# EAGLE schematic power_tower_mast (EAGLE 7.1.0)
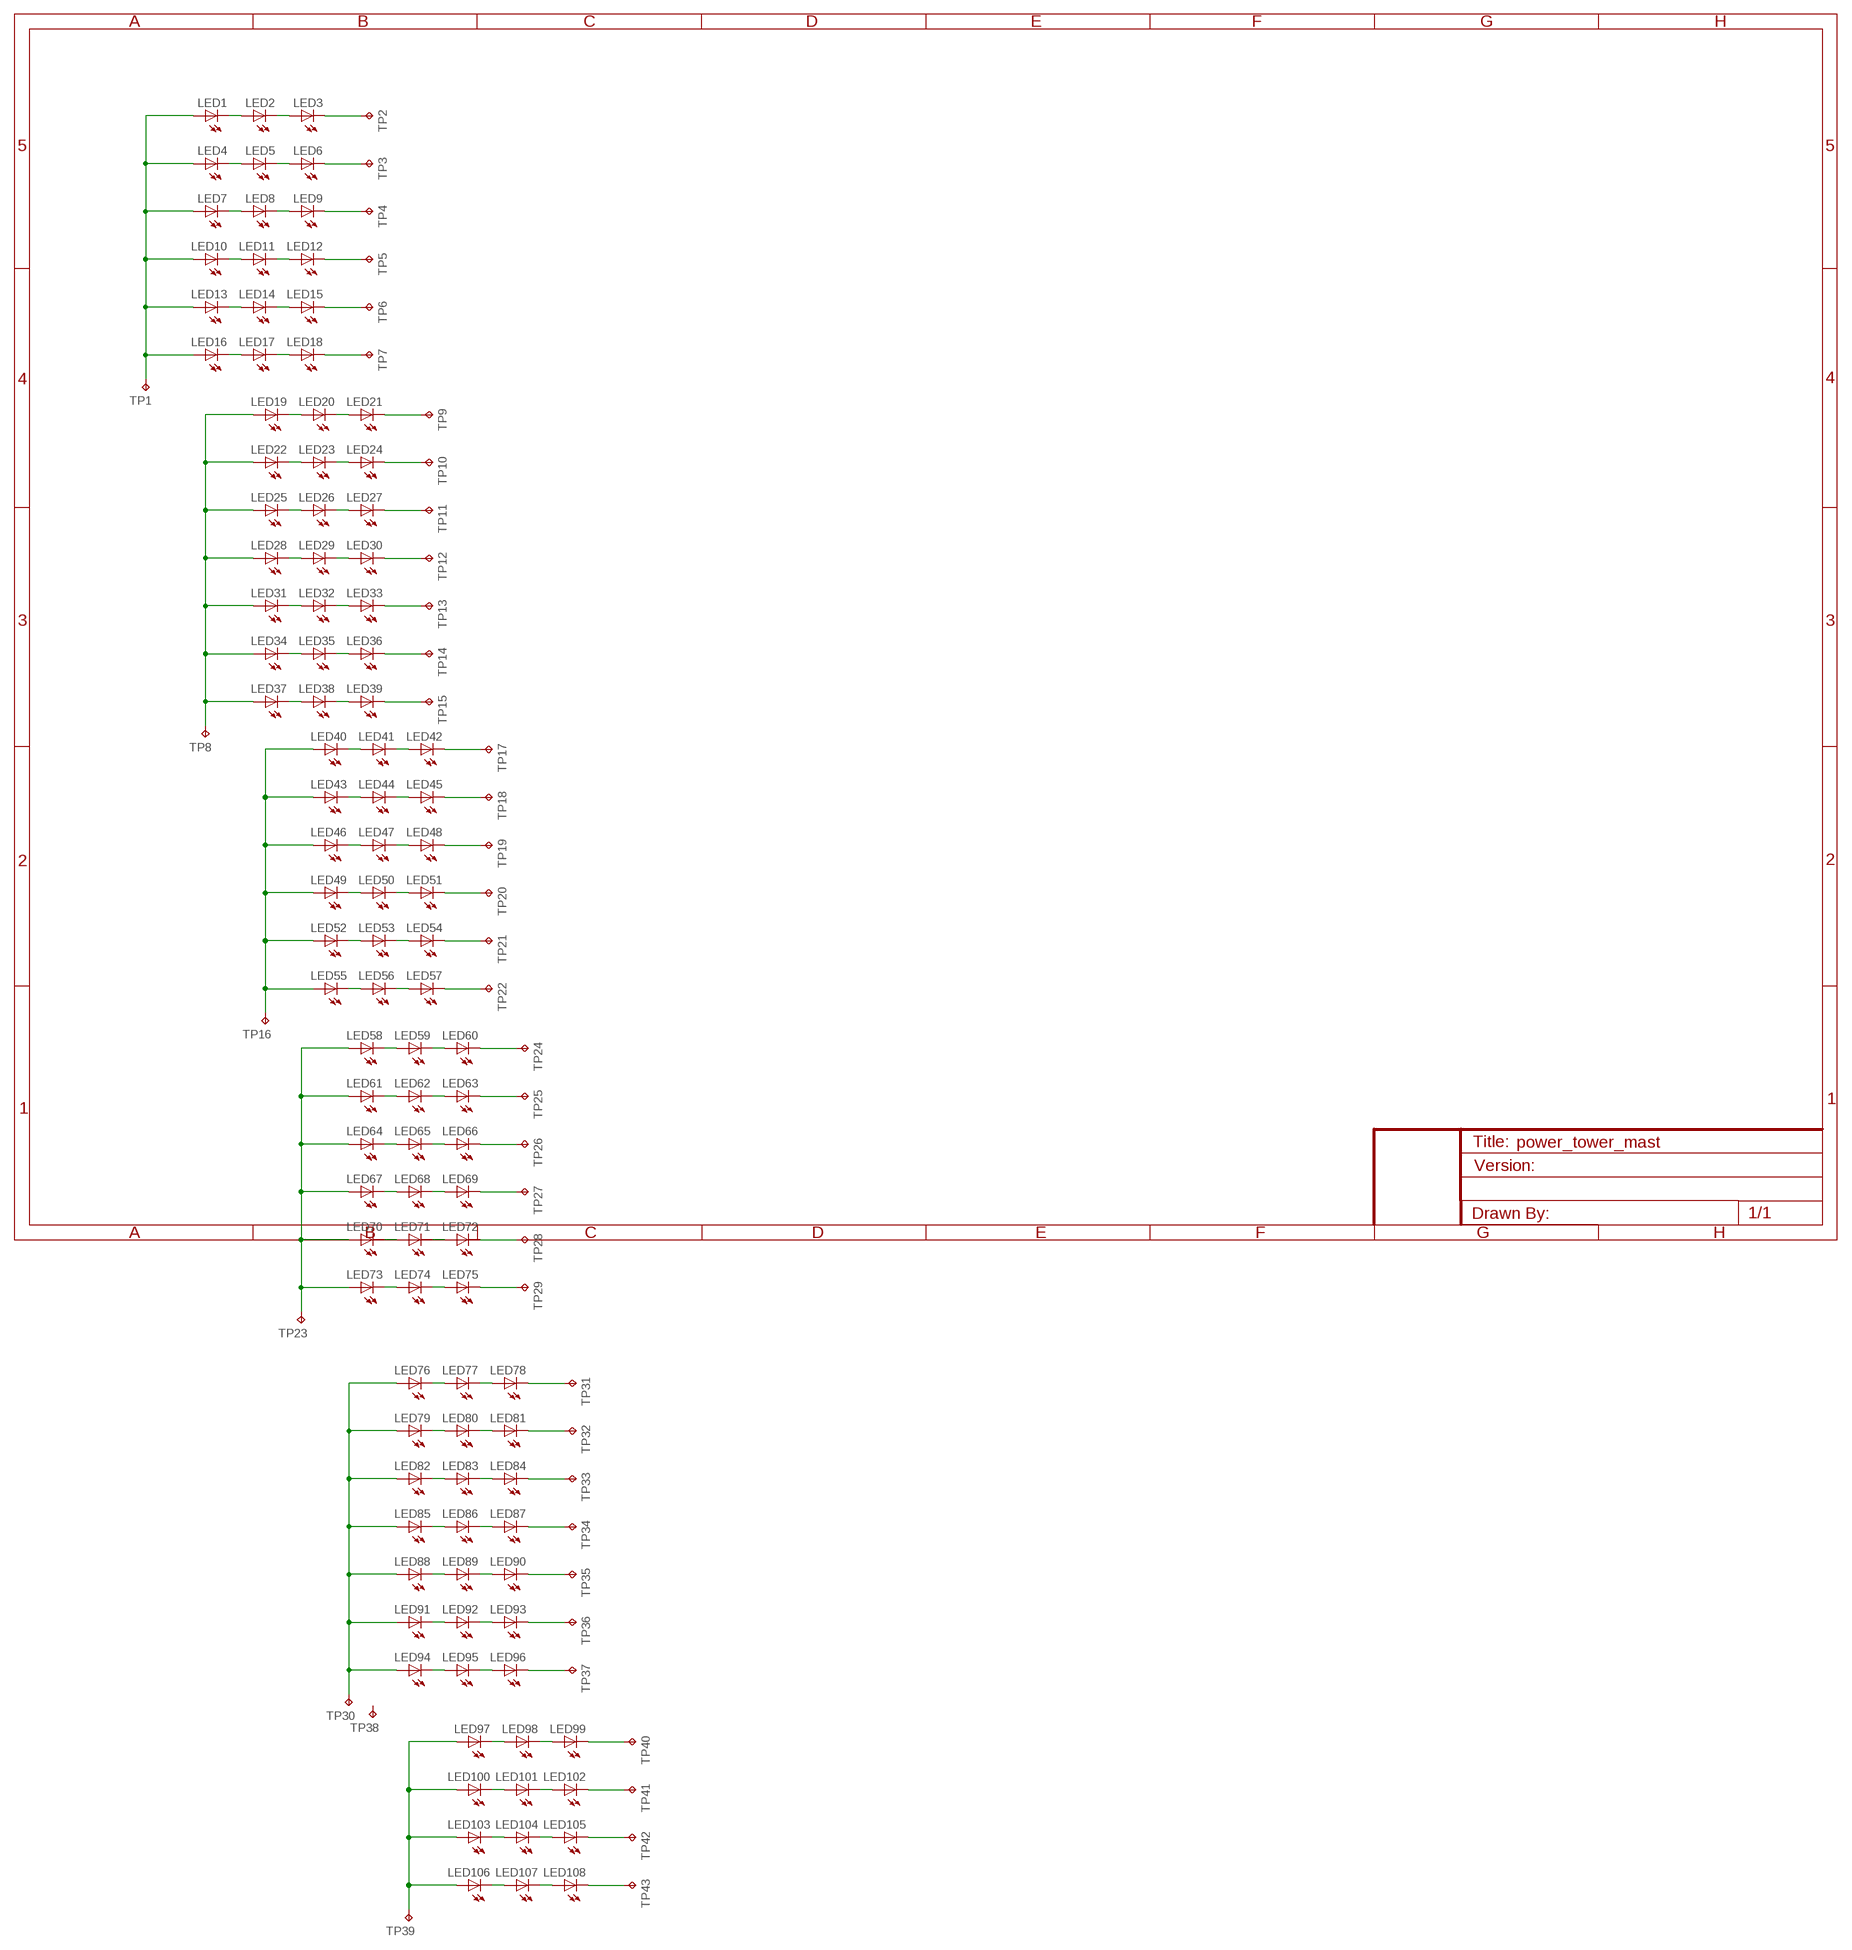
[diagram p0: schematic, sheet 1]

## Parts
LED1  LED0805  [LED_0805]
LED2  LED0805  [LED_0805]
LED3  LED0805  [LED_0805]
LED4  LED0805  [LED_0805]
LED5  LED0805  [LED_0805]
LED6  LED0805  [LED_0805]
LED7  LED0805  [LED_0805]
LED8  LED0805  [LED_0805]
LED9  LED0805  [LED_0805]
LED10  LED0805  [LED_0805]
LED11  LED0805  [LED_0805]
LED12  LED0805  [LED_0805]
LED13  LED0805  [LED_0805]
LED14  LED0805  [LED_0805]
LED15  LED0805  [LED_0805]
LED16  LED0805  [LED_0805]
LED17  LED0805  [LED_0805]
LED18  LED0805  [LED_0805]
LED19  LED0805  [LED_0805]
LED20  LED0805  [LED_0805]
LED21  LED0805  [LED_0805]
LED22  LED0805  [LED_0805]
LED23  LED0805  [LED_0805]
LED24  LED0805  [LED_0805]
LED25  LED0805  [LED_0805]
LED26  LED0805  [LED_0805]
LED27  LED0805  [LED_0805]
LED28  LED0805  [LED_0805]
LED29  LED0805  [LED_0805]
LED30  LED0805  [LED_0805]
LED31  LED0805  [LED_0805]
LED32  LED0805  [LED_0805]
LED33  LED0805  [LED_0805]
LED34  LED0805  [LED_0805]
LED35  LED0805  [LED_0805]
LED36  LED0805  [LED_0805]
LED37  LED0805  [LED_0805]
LED38  LED0805  [LED_0805]
LED39  LED0805  [LED_0805]
LED40  LED0805  [LED_0805]
LED41  LED0805  [LED_0805]
LED42  LED0805  [LED_0805]
LED43  LED0805  [LED_0805]
LED44  LED0805  [LED_0805]
LED45  LED0805  [LED_0805]
LED46  LED0805  [LED_0805]
LED47  LED0805  [LED_0805]
LED48  LED0805  [LED_0805]
LED49  LED0805  [LED_0805]
LED50  LED0805  [LED_0805]
LED51  LED0805  [LED_0805]
LED52  LED0805  [LED_0805]
LED53  LED0805  [LED_0805]
LED54  LED0805  [LED_0805]
LED55  LED0805  [LED_0805]
LED56  LED0805  [LED_0805]
LED57  LED0805  [LED_0805]
LED58  LED0805  [LED_0805]
LED59  LED0805  [LED_0805]
LED60  LED0805  [LED_0805]
LED61  LED0805  [LED_0805]
LED62  LED0805  [LED_0805]
LED63  LED0805  [LED_0805]
LED64  LED0805  [LED_0805]
LED65  LED0805  [LED_0805]
LED66  LED0805  [LED_0805]
LED67  LED0805  [LED_0805]
LED68  LED0805  [LED_0805]
LED69  LED0805  [LED_0805]
LED70  LED0805  [LED_0805]
LED71  LED0805  [LED_0805]
LED72  LED0805  [LED_0805]
LED73  LED0805  [LED_0805]
LED74  LED0805  [LED_0805]
LED75  LED0805  [LED_0805]
LED76  LED0805  [LED_0805]
LED77  LED0805  [LED_0805]
LED78  LED0805  [LED_0805]
LED79  LED0805  [LED_0805]
LED80  LED0805  [LED_0805]
LED81  LED0805  [LED_0805]
LED82  LED0805  [LED_0805]
LED83  LED0805  [LED_0805]
LED84  LED0805  [LED_0805]
LED85  LED0805  [LED_0805]
LED86  LED0805  [LED_0805]
LED87  LED0805  [LED_0805]
LED88  LED0805  [LED_0805]
LED89  LED0805  [LED_0805]
LED90  LED0805  [LED_0805]
LED91  LED0805  [LED_0805]
LED92  LED0805  [LED_0805]
LED93  LED0805  [LED_0805]
LED94  LED0805  [LED_0805]
LED95  LED0805  [LED_0805]
LED96  LED0805  [LED_0805]
LED97  LED0805  [LED_0805]
LED98  LED0805  [LED_0805]
LED99  LED0805  [LED_0805]
LED100  LED0805  [LED_0805]
LED101  LED0805  [LED_0805]
LED102  LED0805  [LED_0805]
LED103  LED0805  [LED_0805]
LED104  LED0805  [LED_0805]
LED105  LED0805  [LED_0805]
LED106  LED0805  [LED_0805]
LED107  LED0805  [LED_0805]
LED108  LED0805  [LED_0805]
TP1  TEST_POINTPAD1-20  [P1-20]
TP2  TEST_POINTPAD1-20  [P1-20]
TP3  TEST_POINTPAD1-20  [P1-20]
TP4  TEST_POINTPAD1-20  [P1-20]
TP5  TEST_POINTPAD1-20  [P1-20]
TP6  TEST_POINTPAD1-20  [P1-20]
TP7  TEST_POINTPAD1-20  [P1-20]
TP8  TEST_POINTPAD1-20  [P1-20]
TP9  TEST_POINTPAD1-20  [P1-20]
TP10  TEST_POINTPAD1-20  [P1-20]
TP11  TEST_POINTPAD1-20  [P1-20]
TP12  TEST_POINTPAD1-20  [P1-20]
TP13  TEST_POINTPAD1-20  [P1-20]
TP14  TEST_POINTPAD1-20  [P1-20]
TP15  TEST_POINTPAD1-20  [P1-20]
TP16  TEST_POINTPAD1-20  [P1-20]
TP17  TEST_POINTPAD1-20  [P1-20]
TP18  TEST_POINTPAD1-20  [P1-20]
TP19  TEST_POINTPAD1-20  [P1-20]
TP20  TEST_POINTPAD1-20  [P1-20]
TP21  TEST_POINTPAD1-20  [P1-20]
TP22  TEST_POINTPAD1-20  [P1-20]
TP23  TEST_POINTPAD1-20  [P1-20]
TP24  TEST_POINTPAD1-20  [P1-20]
TP25  TEST_POINTPAD1-20  [P1-20]
TP26  TEST_POINTPAD1-20  [P1-20]
TP27  TEST_POINTPAD1-20  [P1-20]
TP28  TEST_POINTPAD1-20  [P1-20]
TP29  TEST_POINTPAD1-20  [P1-20]
TP30  TEST_POINTPAD1-20  [P1-20]
TP31  TEST_POINTPAD1-20  [P1-20]
TP32  TEST_POINTPAD1-20  [P1-20]
TP33  TEST_POINTPAD1-20  [P1-20]
TP34  TEST_POINTPAD1-20  [P1-20]
TP35  TEST_POINTPAD1-20  [P1-20]
TP36  TEST_POINTPAD1-20  [P1-20]
TP37  TEST_POINTPAD1-20  [P1-20]
TP38  TEST_POINTPAD1-20  [P1-20]
TP39  TEST_POINTPAD1-20  [P1-20]
TP40  TEST_POINTPAD1-20  [P1-20]
TP41  TEST_POINTPAD1-20  [P1-20]
TP42  TEST_POINTPAD1-20  [P1-20]
TP43  TEST_POINTPAD1-20  [P1-20]

## Nets
N$1: LED2.C LED3.A
N$2: LED1.C LED2.A
N$3: LED20.C LED21.A
N$4: LED19.C LED20.A
N$5: LED5.C LED6.A
N$6: LED4.C LED5.A
N$7: LED23.C LED24.A
N$8: LED22.C LED23.A
N$9: LED8.C LED9.A
N$10: LED7.C LED8.A
N$11: LED26.C LED27.A
N$12: LED25.C LED26.A
N$13: LED11.C LED12.A
N$14: LED10.C LED11.A
N$15: LED29.C LED30.A
N$16: LED28.C LED29.A
N$17: LED14.C LED15.A
N$18: LED13.C LED14.A
N$19: LED32.C LED33.A
N$20: LED31.C LED32.A
N$21: LED17.C LED18.A
N$22: LED16.C LED17.A
N$23: LED35.C LED36.A
N$24: LED34.C LED35.A
N$25: LED41.C LED42.A
N$26: LED40.C LED41.A
N$27: LED38.C LED39.A
N$28: LED37.C LED38.A
N$29: LED44.C LED45.A
N$30: LED43.C LED44.A
N$31: LED47.C LED48.A
N$32: LED46.C LED47.A
N$33: LED50.C LED51.A
N$34: LED49.C LED50.A
N$35: LED53.C LED54.A
N$36: LED52.C LED53.A
N$37: LED56.C LED57.A
N$38: LED55.C LED56.A
N$39: LED59.C LED60.A
N$40: LED58.C LED59.A
N$41: LED62.C LED63.A
N$42: LED61.C LED62.A
N$43: LED65.C LED66.A
N$44: LED64.C LED65.A
N$45: LED68.C LED69.A
N$46: LED67.C LED68.A
N$47: LED71.C LED72.A
N$48: LED70.C LED71.A
N$49: LED74.C LED75.A
N$50: LED73.C LED74.A
N$51: LED77.C LED78.A
N$52: LED76.C LED77.A
N$53: LED80.C LED81.A
N$54: LED79.C LED80.A
N$55: LED83.C LED84.A
N$56: LED82.C LED83.A
N$57: LED86.C LED87.A
N$58: LED85.C LED86.A
N$59: LED89.C LED90.A
N$60: LED88.C LED89.A
N$61: LED92.C LED93.A
N$62: LED91.C LED92.A
N$63: LED95.C LED96.A
N$64: LED94.C LED95.A
N$65: LED98.C LED99.A
N$66: LED97.C LED98.A
N$67: LED101.C LED102.A
N$68: LED100.C LED101.A
N$69: LED104.C LED105.A
N$70: LED103.C LED104.A
N$71: LED107.C LED108.A
N$72: LED106.C LED107.A
VIN1: LED1.A LED4.A LED7.A LED10.A LED13.A LED16.A TP1.TP
VIN2: LED19.A LED22.A LED25.A LED28.A LED31.A LED34.A LED37.A TP8.TP
VIN3: LED40.A LED43.A LED46.A LED49.A LED52.A LED55.A TP16.TP
VIN4: LED58.A LED61.A LED64.A LED67.A LED70.A LED73.A TP23.TP
VIN5: LED76.A LED79.A LED82.A LED85.A LED88.A LED91.A LED94.A TP30.TP
VIN6: LED97.A LED100.A LED103.A LED106.A TP39.TP
VOUT1: LED3.C TP2.TP
VOUT2: LED6.C TP3.TP
VOUT3: LED9.C TP4.TP
VOUT4: LED12.C TP5.TP
VOUT5: LED15.C TP6.TP
VOUT6: LED18.C TP7.TP
VOUT7: LED21.C TP9.TP
VOUT8: LED24.C TP10.TP
VOUT9: LED27.C TP11.TP
VOUT10: LED30.C TP12.TP
VOUT11: LED33.C TP13.TP
VOUT12: LED36.C TP14.TP
VOUT13: LED39.C TP15.TP
VOUT14: LED42.C TP17.TP
VOUT15: LED45.C TP18.TP
VOUT16: LED48.C TP19.TP
VOUT17: LED51.C TP20.TP
VOUT18: LED54.C TP21.TP
VOUT19: LED57.C TP22.TP
VOUT20: LED60.C TP24.TP
VOUT21: LED63.C TP25.TP
VOUT22: LED66.C TP26.TP
VOUT23: LED69.C TP27.TP
VOUT24: LED72.C TP28.TP
VOUT25: LED75.C TP29.TP
VOUT26: LED78.C TP31.TP
VOUT27: LED81.C TP32.TP
VOUT28: LED84.C TP33.TP
VOUT29: LED87.C TP34.TP
VOUT30: LED90.C TP35.TP
VOUT31: LED93.C TP36.TP
VOUT32: LED96.C TP37.TP
VOUT33: LED99.C TP40.TP
VOUT34: LED102.C TP41.TP
VOUT35: LED105.C TP42.TP
VOUT36: LED108.C TP43.TP
Unconnected: TP38.TP

## Library data of the parts
LED1-LED108 = CyberRailGuru:LED: LEDs Standard schematic elements and footprints for 5mm, 3mm, 1206, and 0603 sized LEDs. 5mm - Spark Fun Electronics SKU : COM-00529 (and others)
TP1-TP43 = CyberRailGuru:TEST_POINT: Test pad